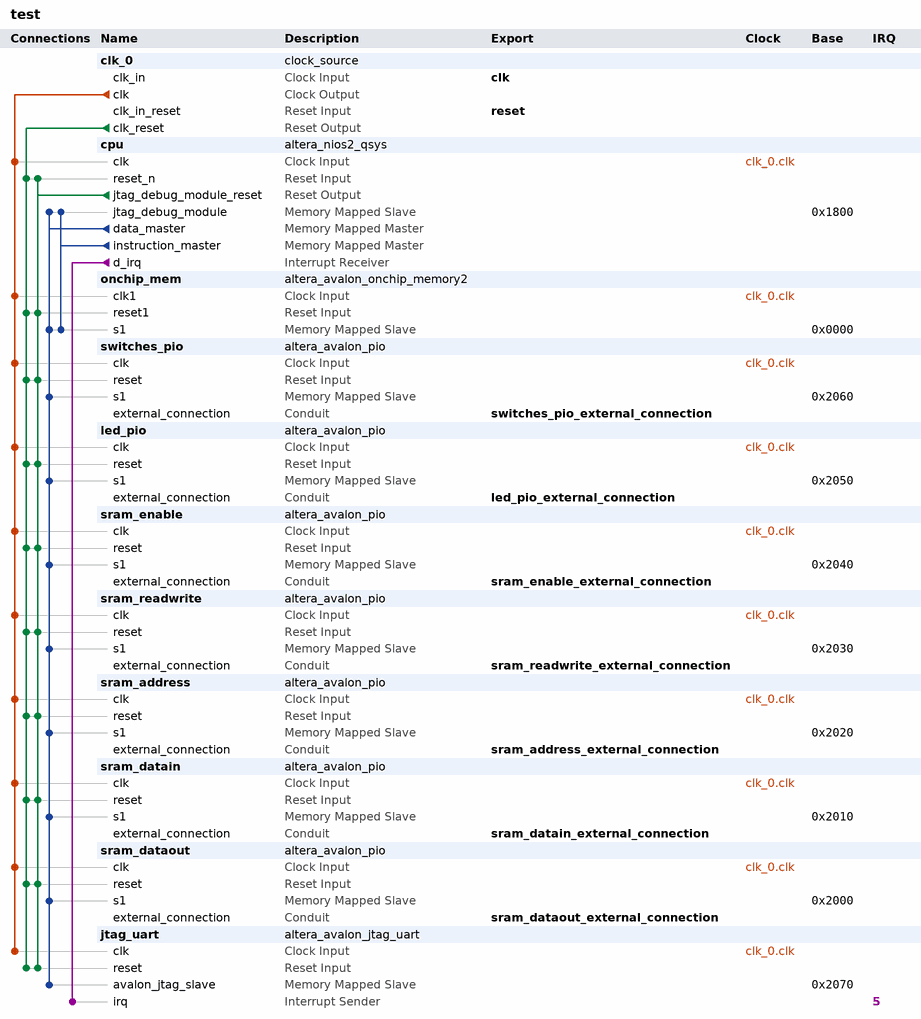
[diagram p0: system contents]
# Platform Designer (Qsys) system test, Cyclone V 5CSEMA5F31C6
# Parameters at their usual value, and those the tool derives, are not listed.
package require -exact qsys 15.1
create_system test
set_project_property DEVICE_FAMILY {Cyclone V}
set_project_property DEVICE 5CSEMA5F31C6

add_instance clk_0 clock_source 15.1
set_instance_parameter_value clk_0 clockFrequency 50000000

add_instance cpu altera_nios2_qsys 15.1
set_instance_parameter_value cpu breakSlave cpu.jtag_debug_module
set_instance_parameter_value cpu exceptionSlave onchip_mem.s1
set_instance_parameter_value cpu icache_size 2048
set_instance_parameter_value cpu impl Tiny
set_instance_parameter_value cpu mmu_TLBMissExcSlave None
set_instance_parameter_value cpu muldiv_multiplierType NoneSmall
set_instance_parameter_value cpu resetSlave onchip_mem.s1
set_instance_parameter_value cpu resetrequest_enabled true

add_instance onchip_mem altera_avalon_onchip_memory2 15.1
set_instance_parameter_value onchip_mem dataWidth 32
set_instance_parameter_value onchip_mem dualPort false
set_instance_parameter_value onchip_mem initMemContent true
set_instance_parameter_value onchip_mem initializationFileName onchip_mem.hex
set_instance_parameter_value onchip_mem memorySize 4096

add_instance switches_pio altera_avalon_pio 15.1
set_instance_parameter_value switches_pio direction Input
set_instance_parameter_value switches_pio width 8

add_instance led_pio altera_avalon_pio 15.1
set_instance_parameter_value led_pio direction Output
set_instance_parameter_value led_pio width 8

add_instance sram_enable altera_avalon_pio 15.1
set_instance_parameter_value sram_enable direction Input
set_instance_parameter_value sram_enable width 1

add_instance sram_readwrite altera_avalon_pio 15.1
set_instance_parameter_value sram_readwrite direction Input
set_instance_parameter_value sram_readwrite width 1

add_instance sram_address altera_avalon_pio 15.1
set_instance_parameter_value sram_address direction Input
set_instance_parameter_value sram_address width 11

add_instance sram_datain altera_avalon_pio 15.1
set_instance_parameter_value sram_datain direction Input
set_instance_parameter_value sram_datain width 8

add_instance sram_dataout altera_avalon_pio 15.1
set_instance_parameter_value sram_dataout direction Output
set_instance_parameter_value sram_dataout width 8

add_instance jtag_uart altera_avalon_jtag_uart 15.1
set_instance_parameter_value jtag_uart simInteractiveOptions NO_INTERACTIVE_WINDOWS

# connections
add_connection clk_0.clk cpu.clk clock
add_connection clk_0.clk jtag_uart.clk clock
add_connection clk_0.clk led_pio.clk clock
add_connection clk_0.clk onchip_mem.clk1 clock
add_connection clk_0.clk sram_address.clk clock
add_connection clk_0.clk sram_datain.clk clock
add_connection clk_0.clk sram_dataout.clk clock
add_connection clk_0.clk sram_enable.clk clock
add_connection clk_0.clk sram_readwrite.clk clock
add_connection clk_0.clk switches_pio.clk clock
add_connection clk_0.clk_reset cpu.reset_n reset
add_connection clk_0.clk_reset jtag_uart.reset reset
add_connection clk_0.clk_reset led_pio.reset reset
add_connection clk_0.clk_reset onchip_mem.reset1 reset
add_connection clk_0.clk_reset sram_address.reset reset
add_connection clk_0.clk_reset sram_datain.reset reset
add_connection clk_0.clk_reset sram_dataout.reset reset
add_connection clk_0.clk_reset sram_enable.reset reset
add_connection clk_0.clk_reset sram_readwrite.reset reset
add_connection clk_0.clk_reset switches_pio.reset reset
add_connection cpu.jtag_debug_module_reset cpu.reset_n reset
add_connection cpu.jtag_debug_module_reset jtag_uart.reset reset
add_connection cpu.jtag_debug_module_reset led_pio.reset reset
add_connection cpu.jtag_debug_module_reset onchip_mem.reset1 reset
add_connection cpu.jtag_debug_module_reset sram_address.reset reset
add_connection cpu.jtag_debug_module_reset sram_datain.reset reset
add_connection cpu.jtag_debug_module_reset sram_dataout.reset reset
add_connection cpu.jtag_debug_module_reset sram_enable.reset reset
add_connection cpu.jtag_debug_module_reset sram_readwrite.reset reset
add_connection cpu.jtag_debug_module_reset switches_pio.reset reset
add_connection cpu.data_master cpu.jtag_debug_module avalon
set_connection_parameter_value cpu.data_master/cpu.jtag_debug_module baseAddress 0x1800
add_connection cpu.data_master jtag_uart.avalon_jtag_slave avalon
set_connection_parameter_value cpu.data_master/jtag_uart.avalon_jtag_slave baseAddress 0x2070
add_connection cpu.data_master led_pio.s1 avalon
set_connection_parameter_value cpu.data_master/led_pio.s1 baseAddress 0x2050
add_connection cpu.data_master onchip_mem.s1 avalon
set_connection_parameter_value cpu.data_master/onchip_mem.s1 baseAddress 0x0000
add_connection cpu.data_master sram_address.s1 avalon
set_connection_parameter_value cpu.data_master/sram_address.s1 baseAddress 0x2020
add_connection cpu.data_master sram_datain.s1 avalon
set_connection_parameter_value cpu.data_master/sram_datain.s1 baseAddress 0x2010
add_connection cpu.data_master sram_dataout.s1 avalon
set_connection_parameter_value cpu.data_master/sram_dataout.s1 baseAddress 0x2000
add_connection cpu.data_master sram_enable.s1 avalon
set_connection_parameter_value cpu.data_master/sram_enable.s1 baseAddress 0x2040
add_connection cpu.data_master sram_readwrite.s1 avalon
set_connection_parameter_value cpu.data_master/sram_readwrite.s1 baseAddress 0x2030
add_connection cpu.data_master switches_pio.s1 avalon
set_connection_parameter_value cpu.data_master/switches_pio.s1 baseAddress 0x2060
add_connection cpu.instruction_master cpu.jtag_debug_module avalon
set_connection_parameter_value cpu.instruction_master/cpu.jtag_debug_module baseAddress 0x1800
add_connection cpu.instruction_master onchip_mem.s1 avalon
set_connection_parameter_value cpu.instruction_master/onchip_mem.s1 baseAddress 0x0000
add_connection cpu.d_irq jtag_uart.irq interrupt
set_connection_parameter_value cpu.d_irq/jtag_uart.irq irqNumber 5

# exported interfaces
add_interface clk clock sink
set_interface_property clk EXPORT_OF clk_0.clk_in
add_interface led_pio_external_connection conduit end
set_interface_property led_pio_external_connection EXPORT_OF led_pio.external_connection
add_interface reset reset sink
set_interface_property reset EXPORT_OF clk_0.clk_in_reset
add_interface sram_address_external_connection conduit end
set_interface_property sram_address_external_connection EXPORT_OF sram_address.external_connection
add_interface sram_datain_external_connection conduit end
set_interface_property sram_datain_external_connection EXPORT_OF sram_datain.external_connection
add_interface sram_dataout_external_connection conduit end
set_interface_property sram_dataout_external_connection EXPORT_OF sram_dataout.external_connection
add_interface sram_enable_external_connection conduit end
set_interface_property sram_enable_external_connection EXPORT_OF sram_enable.external_connection
add_interface sram_readwrite_external_connection conduit end
set_interface_property sram_readwrite_external_connection EXPORT_OF sram_readwrite.external_connection
add_interface switches_pio_external_connection conduit end
set_interface_property switches_pio_external_connection EXPORT_OF switches_pio.external_connection

set_interconnect_requirement {$system} qsys_mm.clockCrossingAdapter HANDSHAKE
set_interconnect_requirement {$system} qsys_mm.insertDefaultSlave FALSE
set_interconnect_requirement {$system} qsys_mm.maxAdditionalLatency 1

save_system test.qsys
